# Altium schematic sheet Schema.SchDoc
size A4; SheetNumber: 1; SheetTotal: 1
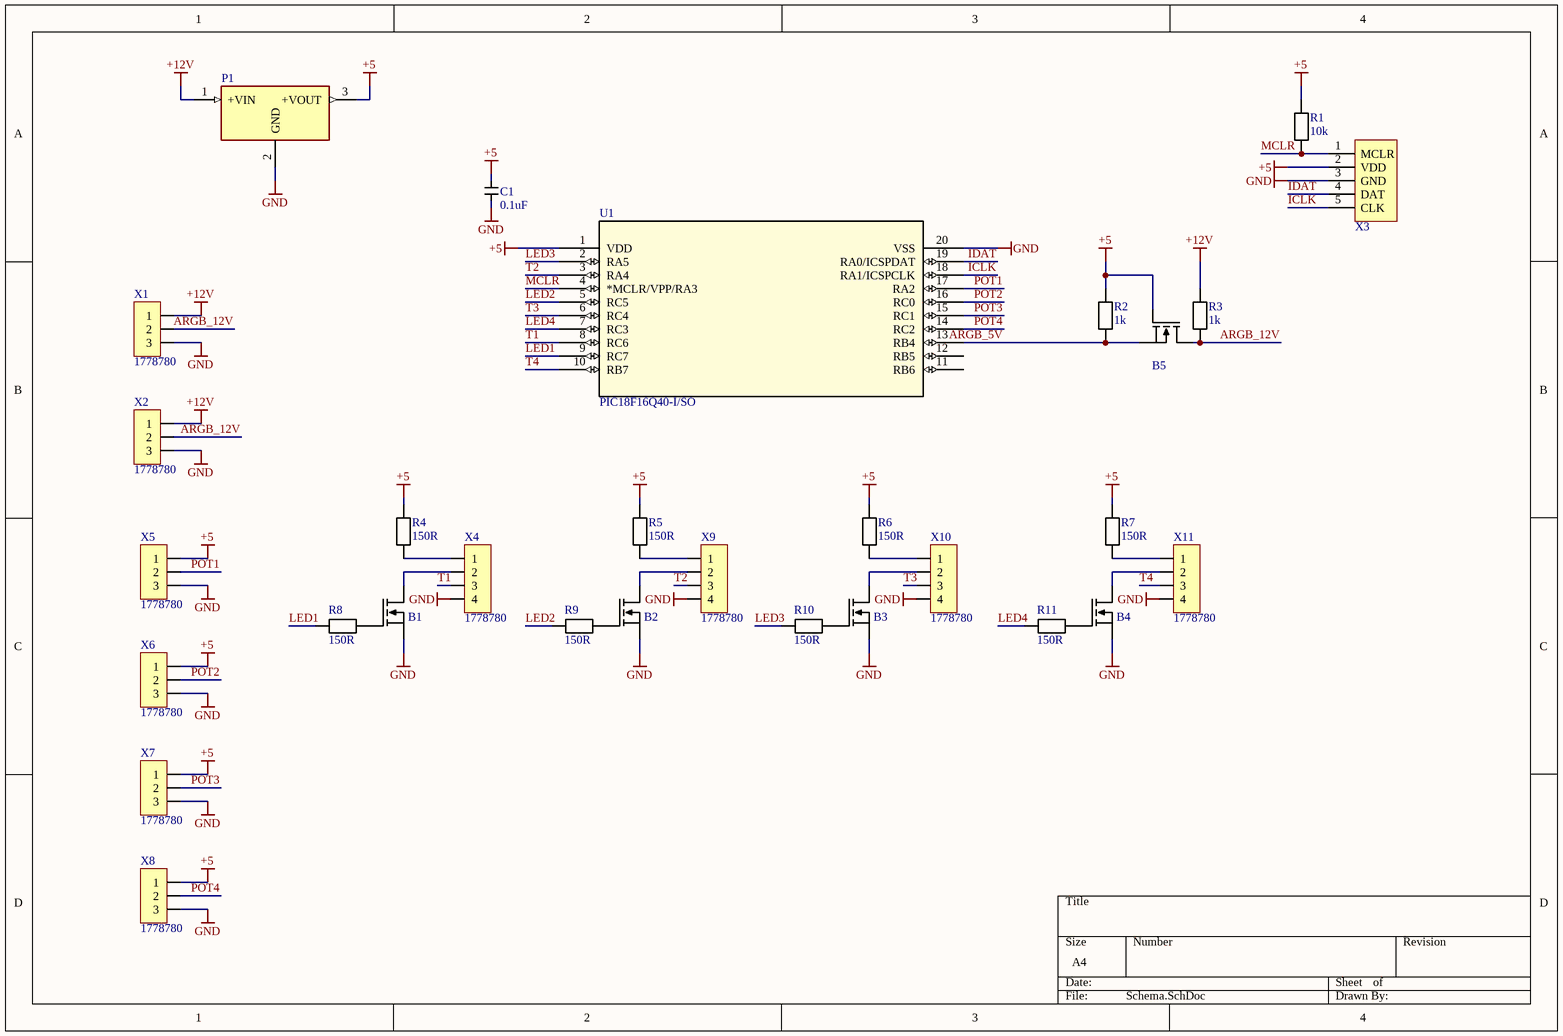
[diagram p0: Schema.SchDoc]

## Parts
B1  N Kanal FET  [SOT23-3]  (value not drawn)
B2  N Kanal FET  [SOT23-3]  (value not drawn)
B3  N Kanal FET  [SOT23-3]  (value not drawn)
B4  N Kanal FET  [SOT23-3]  (value not drawn)
B5  N Kanal FET  [SOT23-3]  (value not drawn)
C1  value 0.1uF  [CAP CER 0805 H]  (hidden comment: Capacitor 0805)
P1  TSR_1-2450  [TSR_1-2450]  (value not drawn)
R1  value 10k  [RES 0603 H]  (hidden comment: Resistor 0603)
R2  value 1k  [RES 0603 H]  (hidden comment: Resistor 0603)
R3  value 1k  [RES 0603 H]  (hidden comment: Resistor 0603)
R4  value 150R  [RES 0603 H]  (hidden comment: Resistor 0603)
R5  value 150R  [RES 0603 H]  (hidden comment: Resistor 0603)
R6  value 150R  [RES 0603 H]  (hidden comment: Resistor 0603)
R7  value 150R  [RES 0603 H]  (hidden comment: Resistor 0603)
R8  value 150R  [RES 0603 H]  (hidden comment: Resistor 0603)
R9  value 150R  [RES 0603 H]  (hidden comment: Resistor 0603)
R10  value 150R  [RES 0603 H]  (hidden comment: Resistor 0603)
R11  value 150R  [RES 0603 H]  (hidden comment: Resistor 0603)
U1  PIC18F16Q40-I/SO  [SOIC20_SO_MCH-M]
X1  1778780  [Phoenix 3Pos Header]
X2  1778780  [Phoenix 3Pos Header]
X3  ICSP  [5Pin_Header]  (value not drawn)
X4  1778780  [Phoenix 4Pos Header]
X5  1778780  [Phoenix 3Pos Header]
X6  1778780  [Phoenix 3Pos Header]
X7  1778780  [Phoenix 3Pos Header]
X8  1778780  [Phoenix 3Pos Header]
X9  1778780  [Phoenix 4Pos Header]
X10  1778780  [Phoenix 4Pos Header]
X11  1778780  [Phoenix 4Pos Header]

## Nets
+5: B5.1(Gate) C1.2 P1.3(+VOUT) R1.2 R2.2 R4.2 R5.2 R6.2 R7.2 U1.1(VDD) X3.2(VDD) X5.1 X6.1 X7.1 X8.1
+12V: P1.1(+VIN) R3.2 X1.1 X2.1
GND: B1.2(Source) B2.2(Source) B3.2(Source) B4.2(Source) C1.1 P1.2(GND) U1.20(VSS) X1.3 X2.3 X3.3(GND) X4.4 X5.3 X6.3 X7.3 X8.3 X9.4 X10.4 X11.4
ARGB_5V: B5.2(Source) R2.1 U1.13(RB4)
ARGB_12V: B5.3(Drain) R3.1 X1.2 X2.2
ICLK: U1.18(RA1/ICSPCLK) X3.5(CLK)
IDAT: U1.19(RA0/ICSPDAT) X3.4(DAT)
LED1: R8.2 U1.9(RC7)
LED2: R9.2 U1.5(RC5)
LED3: R10.2 U1.2(RA5)
LED4: R11.2 U1.7(RC3)
MCLR: R1.1 U1.4(*MCLR/VPP/RA3) X3.1(MCLR)
POT1: U1.17(RA2) X5.2
POT2: U1.16(RC0) X6.2
POT3: U1.15(RC1) X7.2
POT4: U1.14(RC2) X8.2
T1: U1.8(RC6) X4.3
T2: U1.3(RA4) X9.3
T3: U1.6(RC4) X10.3
T4: U1.10(RB7) X11.3
NetB1_1: B1.1(Gate) R8.1
NetB1_3: B1.3(Drain) X4.2
NetB2_1: B2.1(Gate) R9.1
NetB2_3: B2.3(Drain) X9.2
NetB3_1: B3.1(Gate) R10.1
NetB3_3: B3.3(Drain) X10.2
NetB4_1: B4.1(Gate) R11.1
NetB4_3: B4.3(Drain) X11.2
NetR4_1: R4.1 X4.1
NetR5_1: R5.1 X9.1
NetR6_1: R6.1 X10.1
NetR7_1: R7.1 X11.1

Not connected (* = marked no-connect by the designer): U1 11(RB6) 12(RB5)

## Library data of the parts
P1 = TSR_1-2450: 1 Amp POL switching regulator, 4.6 to -36 VDC input, pos.-pos. circuit, LM78 compatible, SIP-3; MF: Traco Power; MP: TSR 1-2450; Purchase-URL: https://pricing.snapeda.com/search/part/TSR 1-2450/?ref=eda; Package: SIP-3 Traco Power; Check_prices: https://www.snapeda.com/parts/TSR%201-2450/Traco%20Power/view-part/5914857/?ref=eda; Value: *; Price: None; Availability: In Stock; SnapEDA_Link: https://www.snapeda.com/parts/TSR%201-2450/Traco%20Power/view-part/5914857/?ref=snap
U1 = PIC18F16Q40-I/SO: No Description Available; Mfr_Name: Microchip; Copyright: Copyright (C) 2021 Ultra Librarian. All rights reserved.; Manufacturer_Part_Number: PIC18F16Q40-I/SO; Digi-Key_Part_Number_1: 150-PIC18F16Q40-I/SO-ND; RefDes: RefDes; Type: DEV
X1 X2 X5-X8 = Phoenix 3Pos Header
X4 X9-X11 = Phoenix 4Pos Header